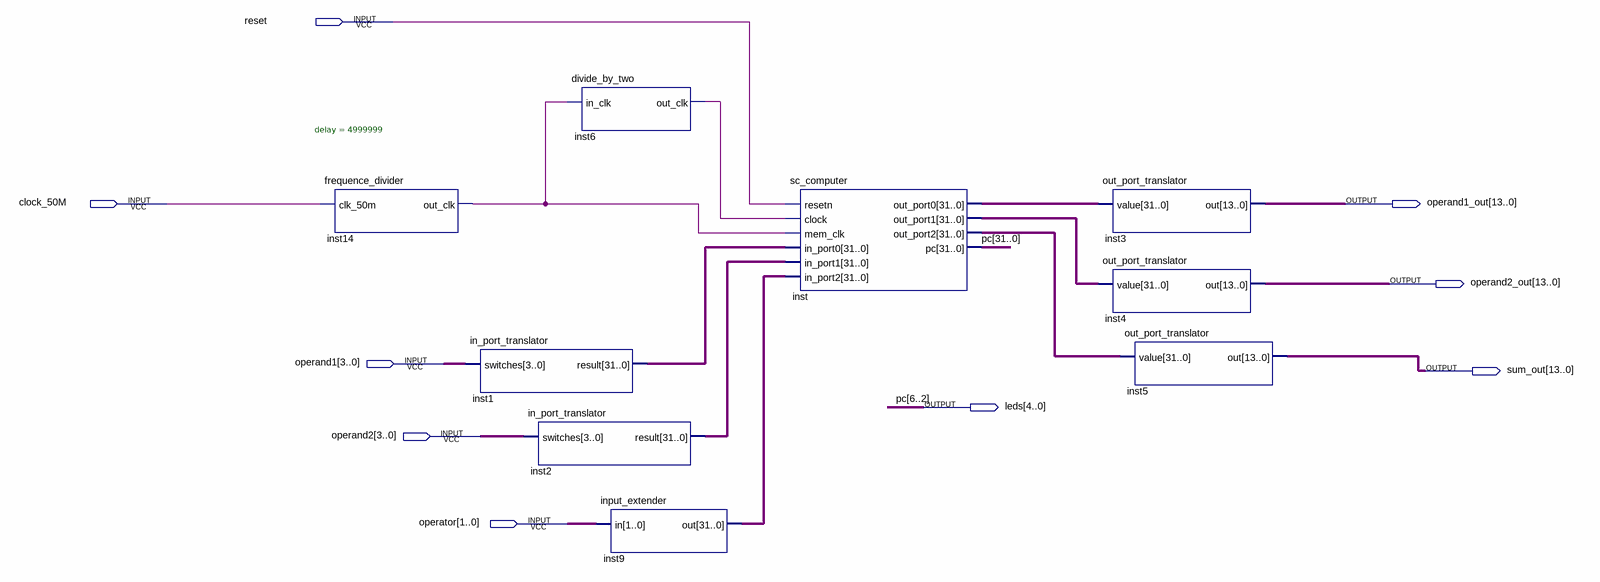
[diagram p0: schematic sheet]
// Quartus schematic sc_computer_with_io.bdf as structural Verilog: 9 symbols, 9 pins
module sc_computer_with_io (
  input  reset,
  input  clock_50M,
  input  [3:0] operand1,
  input  [3:0] operand2,
  input  [1:0] operator,
  output [13:0] operand1_out,
  output [13:0] operand2_out,
  output [13:0] sum_out,
  output [4:0] leds
);

  wire inst6_out_clk, inst14_out_clk;
  wire [31:0] inst1_result, inst2_result, inst9_out, inst_out_port0, inst_out_port1, inst_out_port2, pc;

  frequence_divider #(.delay(4999999)) inst14 (.clk_50m(clock_50M), .out_clk(inst14_out_clk));
  in_port_translator inst1 (.switches(operand1), .result(inst1_result));
  in_port_translator inst2 (.switches(operand2), .result(inst2_result));
  divide_by_two inst6 (.in_clk(inst14_out_clk), .out_clk(inst6_out_clk));
  input_extender inst9 (.in(operator), .out(inst9_out));
  sc_computer inst (
    .resetn(reset), .clock(inst6_out_clk), .mem_clk(inst14_out_clk), .in_port0(inst1_result),
    .in_port1(inst2_result), .in_port2(inst9_out), .out_port0(inst_out_port0), .out_port1(inst_out_port1),
    .out_port2(inst_out_port2), .pc({pc[31:7], leds, pc[1:0]}));
  out_port_translator inst3 (.value(inst_out_port0), .out(operand1_out));
  out_port_translator inst4 (.value(inst_out_port1), .out(operand2_out));
  out_port_translator inst5 (.value(inst_out_port2), .out(sum_out));

  // Other names for the same wires on the sheet: pc[6:2] = leds
endmodule
